# EAGLE schematic EEZ PSU power board r5B8 (EAGLE 6.1)
Assembly variants: Farnell, TME

## Sheet 1 of 5
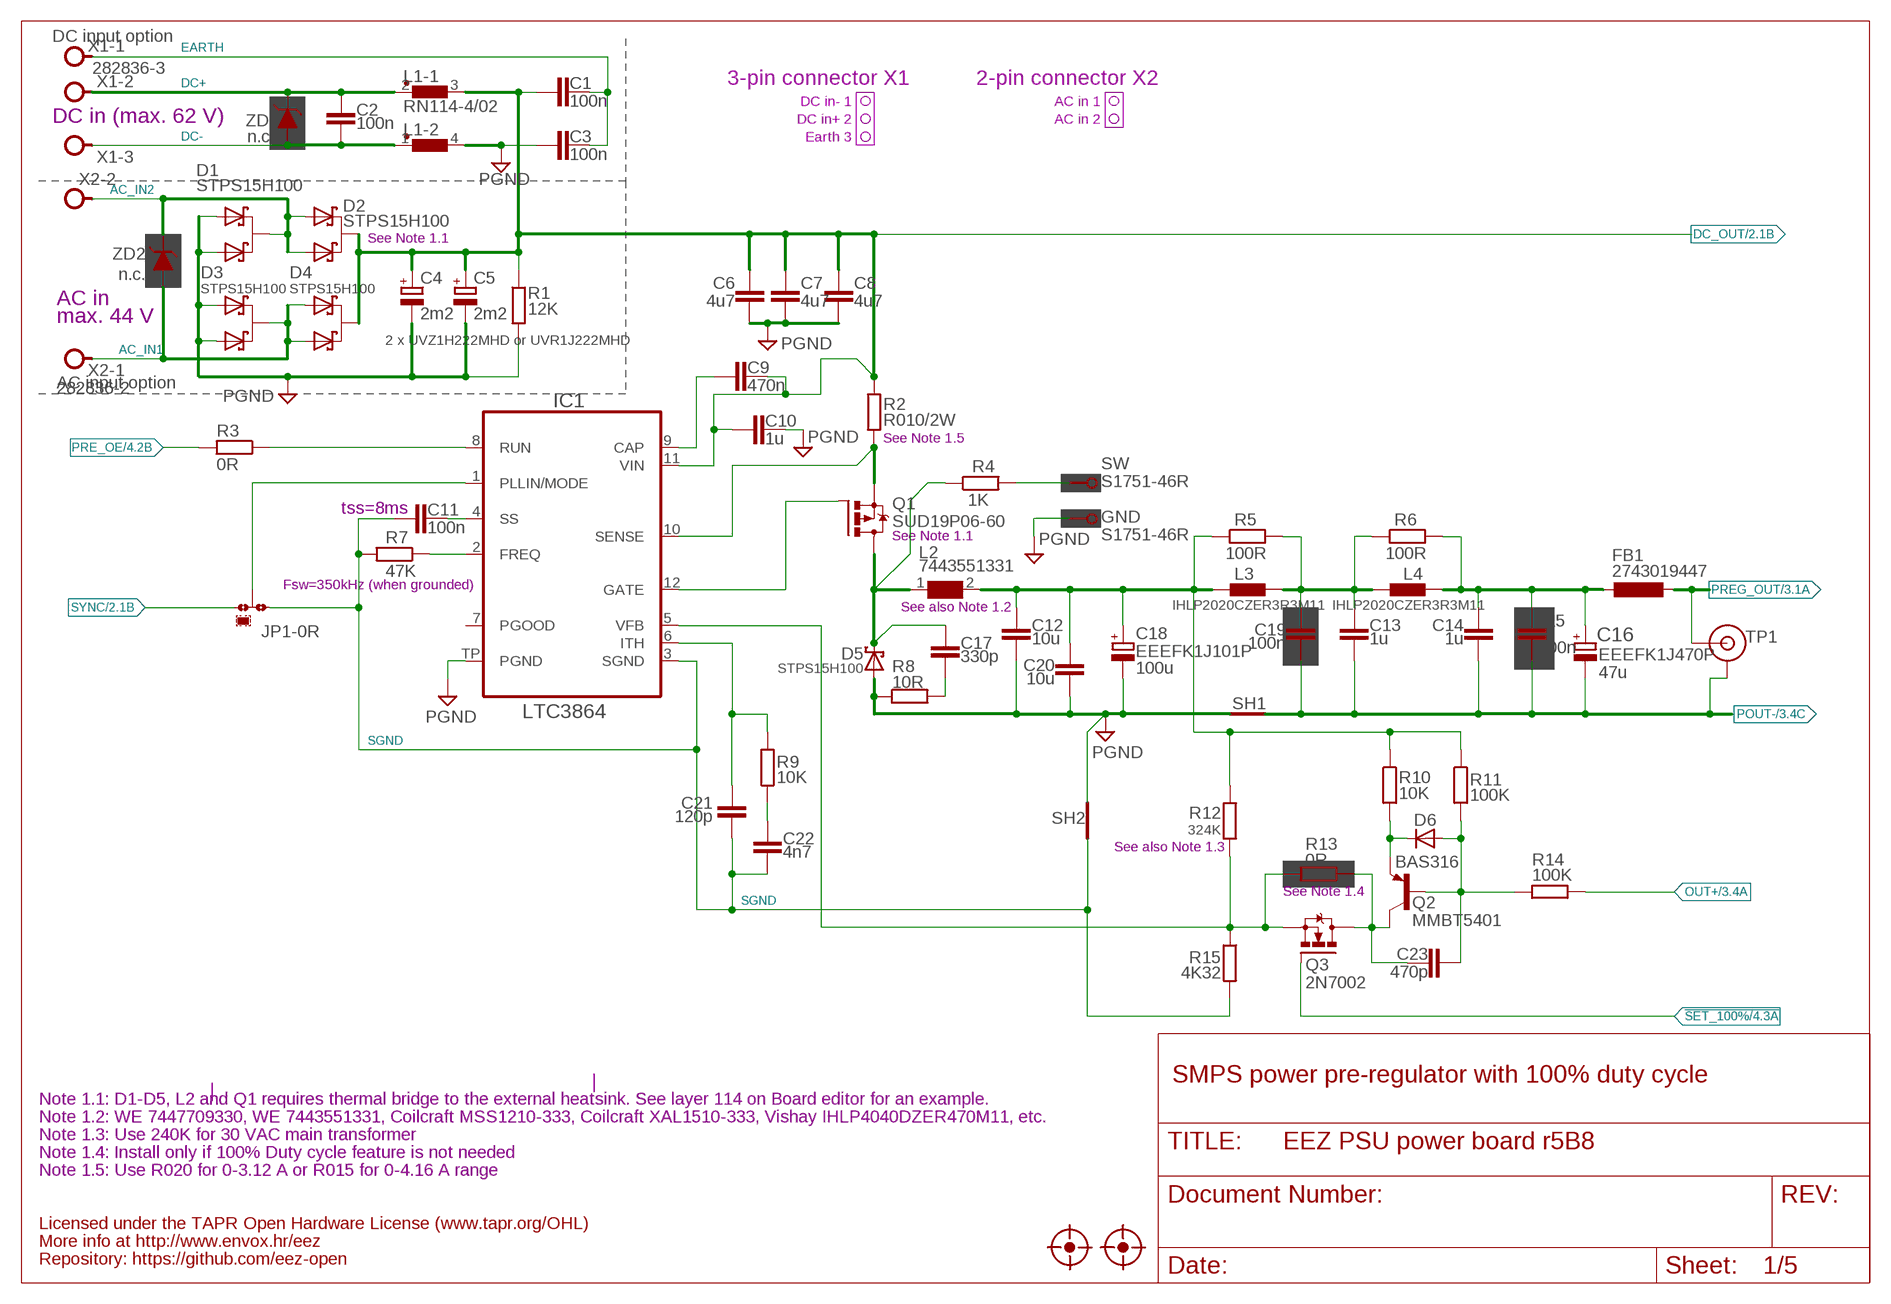
[diagram p0: schematic, sheet 1]

### Parts
C1  100n  C-EUC1206  [C1206]
C2  100n  C-EUC1206  [C1206]
C3  100n  C-EUC1206  [C1206]
C4  2m2  ECAP7.5G_18MM  [ECAP7.5/18]
C5  2m2  ECAP7.5G_18MM  [ECAP7.5/18]
C6  4u7  C-EUC1210  [C1210]
C7  4u7  C-EUC1210  [C1210]
C8  4u7  C-EUC1210  [C1210]
C9  470n  C-EUC0805  [C0805]
C10  1u  C-EUC1206  [C1206]
C11  100n  C-EUC0805  [C0805]
C12  10u  C-EUC1210  [C1210]
C13  1u  C-EUC1206  [C1206]
C14  1u  C-EUC1206  [C1206]
C15  100n  C-EUC0805  [C0805]
C16  EEEFK1J470P  EEE-FK1J470P-CASE-F  [CAPAE830X1050N]
C17  330p  C-EUC0805  [C0805]
C18  EEEFK1J101P  ECAPF  [PANASONIC_F]
C19  100n  C-EUC0805  [C0805]
C20  10u  C-EUC1210  [C1210]
C21  120p  C-EUC0805  [C0805]
C22  4n7  C-EUC0805  [C0805]
C23  470p  C-EUC0805  [C0805]
D1  STPS15H100  VS-6CWQ06FNPBF  [TO252@1]
D2  STPS15H100  VS-6CWQ06FNPBF  [TO252@1]
D3  STPS15H100  VS-6CWQ06FNPBF  [TO252@1]
D4  STPS15H100  VS-6CWQ06FNPBF  [TO252@1]
D5  STPS15H100  SCHOTTKYTO252  [TO252]
D6  BAS316  DIODE-SOD323-W  [SOD323-W]
FB1  2743019447  L-EUL1812  [L1812]
GND  S1751-46R  PCB_TEST_TABSMD  [S1751-46R]
IC1  LTC3864  [LTC_05-08-1666]
JP1  0R-JUMPA  [A0R-JMP]
L1  RN114-4/02  RN114  [RN114]
L2  7443551331  WE-HCI-7443551331_1350/1365  [WE-HCI_1350/1365]
L3  IHLP2020CZER3R3M11  IHLP-2020BZ-11  [IHLP-2020BZ-11]
L4  IHLP2020CZER3R3M11  IHLP-2020BZ-11  [IHLP-2020BZ-11]
Q1  SUD19P06-60  P-MOSFETDPAK  [TO229P990X239-3N]
Q2  MMBT5401  BC857B-PNP-SOT23-BEC  [SOT23-BEC]
Q3  2N7002  [SOT103P240X110-3N]
R1  12K  R-EU_R1206  [R1206]
R2  R010/2W  R-EU_R2512  [R2512]
R3  0R  R-EU_R0805  [R0805]
R4  1K  R-EU_R0805  [R0805]
R5  100R  R-EU_R0805  [R0805]
R6  100R  R-EU_R0805  [R0805]
R7  47K  R-EU_R0805  [R0805]
R8  10R  R-EU_R1206  [R1206]
R9  10K  R-EU_R0805  [R0805]
R10  10K  R-EU_R0805  [R0805]
R11  100K  R-EU_R0805  [R0805]
R12  324K  R-EU_R0805  [R0805]
R13  0R  R-EU_R0805  [R0805]
R14  100K  R-EU_R0805  [R0805]
R15  4K32  R-EU_R0805  [R0805]
SH1  Pgnd to Pout- short  SHORTNOHOLE  [SHORT_NOHOLE]
SH2  Sgnd to Pgnd short  SHORTNOHOLE  [SHORT_NOHOLE]
SW  S1751-46R  PCB_TEST_TABSMD  [S1751-46R]
TP1  TEST_POINT  [TP_1.1MM]
U$11  FIDUCIAL_2  [FIDUCIAL_DUAL]
U$12  FIDUCIAL_2  [FIDUCIAL_DUAL]
X1  282836-3  TBLOCK5.0_3A  [TBLOCK5.0_3]
X2  282836-2  TBLOCK5.0_2A  [TBLOCK5.0_2]
ZD1  n.c.  P6SMB68A  [DO214AA]
ZD2  n.c.  P6SMB68A  [DO214AA]

### Nets
!SET_100%: Q3.1(G) ; also sheet 4
AC_IN1: D3.3(C) D4.1(A1) D4.2(A2) X2.1 ZD2.A
AC_IN2: D1.3(C) D2.1(A1) D2.2(A2) X2.2 ZD2.C
DC+: C2.2 L1.2 X1.2 ZD1.C
DC-: C2.1 L1.1 X1.3 ZD1.A
DC_OUT: C1.2 C4.+ C5.+ C6.1 C7.1 C8.1 C9.2 C10.1 D2.3(C) D4.3(C) IC1.11(VIN) L1.3 R1.1 R2.1 ; also sheet 2,3
EARTH: C1.1 C3.2 X1.1
FB: IC1.5(VFB) Q3.2(S) R12.2 R13.2 R15.1
GND [gnd]: C3.1 C4.- C5.- C6.2 C7.2 C8.2 C10.2 C12.2 C18.2(-) C20.2 D1.1(A1) D1.2(A2) D3.1(A1) D3.2(A2) D5.1(A) D5.2(A) GND.P$1 IC1.TP(PGND) L1.4 R1.2 R8.1 SH1.P$2(GND_B) SH2.P$2(GND_B) ; supply symbol labelled PGND ; also sheet 2,3,4,5
L_OUT: C12.1 C18.1(+) C20.1 L2.2 L3.1 R5.1 R10.1 R11.1 R12.1
MODE: IC1.1(PLLIN/MODE) JP1.2
N$7: R4.2 SW.P$1
N$19: D6.C Q2.E R10.2
N$20: C21.1 IC1.6(ITH) R9.2
N$21: C22.1 R9.1
N$23: C9.1 IC1.9(CAP)
N$30: IC1.12(GATE) Q1.1(G)
N$31: IC1.2(FREQ) R7.1
N$33: C11.2 IC1.4(SS)
N$34: C23.1 Q2.C Q3.3(D) R13.1
N$35: C13.1 C19.2 L3.2 L4.1 R5.2 R6.1
N$36: IC1.8(RUN) R3.1
N$38: C17.2 R8.2
N$79: C23.2 D6.A Q2.B R11.2 R14.1
OUT+: R14.2 ; also sheet 3,5
P_OUT: C14.1 C15.1 C16.1 FB1.1 L4.2 R6.2
POUT-: C13.2 C14.2 C15.2 C16.2 C19.1 SH1.P$1(GND_A) TP1.GND ; also sheet 3
PRE_OE: R3.2 ; also sheet 4
PREG_OUT: FB1.2 TP1.TIP ; also sheet 3
SENSE: IC1.10(SENSE) Q1.3(S) R2.2
SGND: C11.1 C21.2 C22.2 IC1.3(SGND) JP1.1 R7.2 R15.2 SH2.P$1(GND_A)
SW: C17.1 D5.3(C) L2.1 Q1.2(D) R4.1
SYNC: JP1.3 ; also sheet 2
Unconnected: IC1.7(PGOOD)

### Notes on the sheet
- DC input option
- 3-pin connector X1 | 2-pin connector X2
- DC in- 1 | AC in 1
- DC in+ 2 | AC in 2
- DC in (max. 62 V)
- Earth 3
- See Note 1.1
- AC in
- max. 44 V
- 2 x UVZ1H222MHD or UVR1J222MHD
- AC input option
- See Note 1.5
- tss=8ms
- See Note 1.1
- Fsw=350kHz (when grounded)
- See also Note 1.2
- 100u | 47u
- See also Note 1.3
- See Note 1.4
- SMPS power pre-regulator with 100% duty cycle
- Note 1.1: D1-D5, L2 and Q1 requires thermal bridge to the external heatsink. See layer 114 on Board editor for an example.
- Note 1.2: WE 7447709330, WE 7443551331, Coilcraft MSS1210-333, Coilcraft XAL1510-333, Vishay IHLP4040DZER470M11, etc.
- Note 1.3: Use 240K for 30 VAC main transformer
- Note 1.4: Install only if 100% Duty cycle feature is not needed
- Note 1.5: Use R020 for 0-3.12 A or R015 for 0-4.16 A range
- Licensed under the TAPR Open Hardware License (www.tapr.org/OHL)
- More info at http://www.envox.hr/eez
- Repository: https://github.com/eez-open

## Sheet 2 of 5
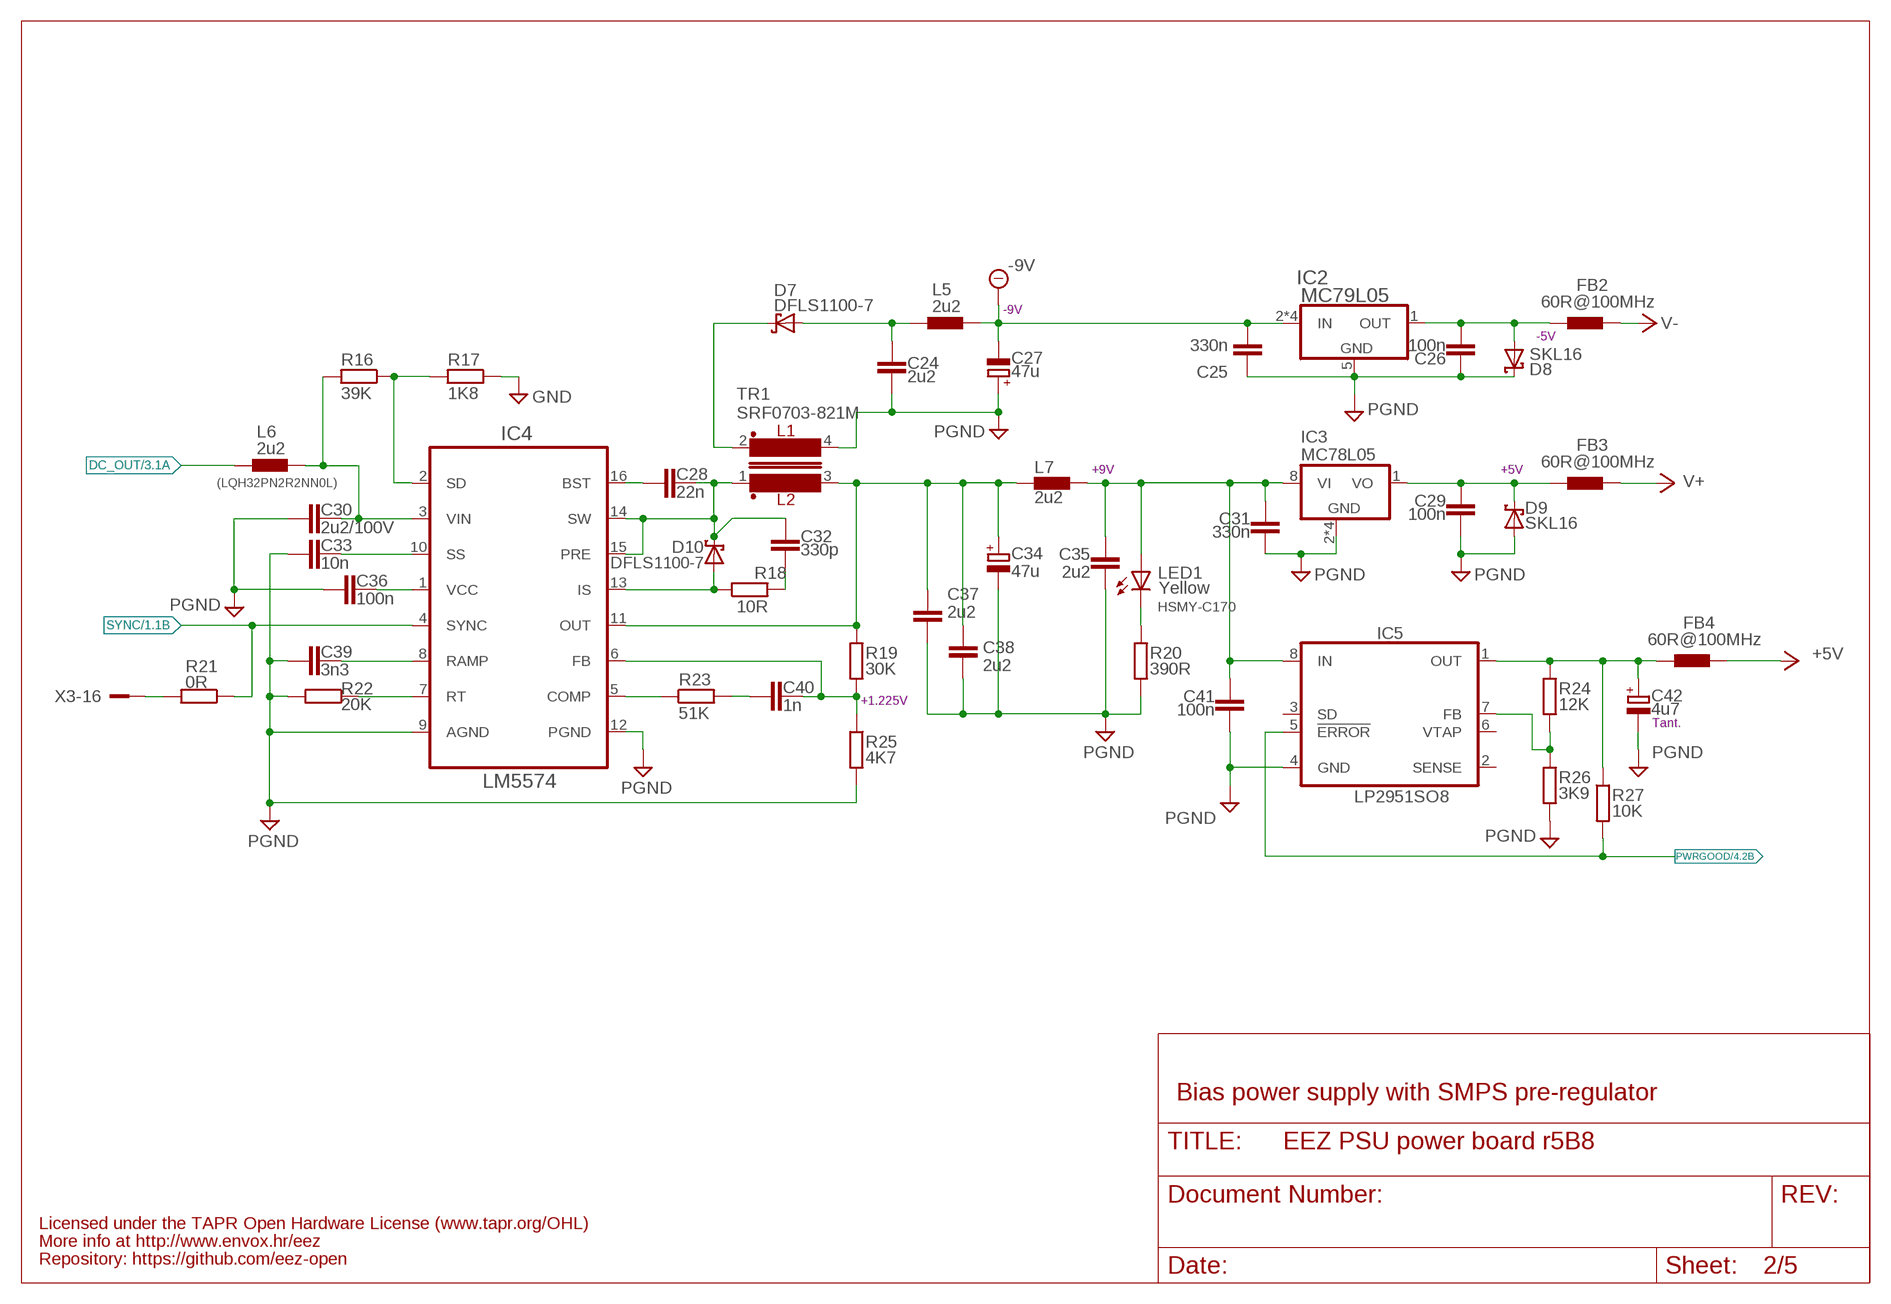
[diagram p1: schematic, sheet 2]

### Parts
C24  2u2  C-EUC0805  [C0805]
C25  330n  C-EUC0805  [C0805]
C26  100n  C-EUC0805  [C0805]
C27  47u  ECAPPANASONIC_H  [CAPAE660X610N]
C28  22n  C-EUC0805  [C0805]
C29  100n  C-EUC0805  [C0805]
C30  2u2/100V  C-EUC1210  [C1210]
C31  330n  C-EUC0805  [C0805]
C32  330p  C-EUC0805  [C0805]
C33  10n  C-EUC0805  [C0805]
C34  47u  ECAPPANASONIC_H  [CAPAE660X610N]
C35  2u2  C-EUC0805  [C0805]  (variant Farnell: 2320829)  (variant TME: CL21B225KAFNNNG )
C36  100n  C-EUC0805  [C0805]
C37  2u2  C-EUC0805  [C0805]  (variant Farnell: 2320829)  (variant TME: CL21B225KAFNNNG )
C38  2u2  C-EUC0805  [C0805]  (variant Farnell: 2320829)  (variant TME: CL21B225KAFNNNG )
C39  3n3  C-EUC0805  [C0805]
C40  1n  C-EUC0805  [C0805]
C41  100n  C-EUC0805  [C0805]
C42  4u7  ECAP1206  [EC1206]
D7  DFLS1100-7  SCHOTTKYSOD123  [SOD123]
D8  SKL16  SCHOTTKYSOD123  [SOD123]
D9  SKL16  SCHOTTKYSOD123  [SOD123]
D10  DFLS1100-7  SCHOTTKYSOD123  [SOD123]
FB2  60R@100MHz  FERRITE_BEAD0603  [BEAD0603]
FB3  60R@100MHz  FERRITE_BEAD0603  [BEAD0603]
FB4  60R@100MHz  FERRITE_BEAD0603  [BEAD0603]
IC2  MC79L05  MC79LXXSOIC  [SOIC127P600X173-8N]
IC3  MC78L05  MC78LXXSOIC8  [SOIC127P600X173-8N]
IC4  LM5574  [SOP65P640X110-16N]
IC5  LP2951SO8  [SOIC127P600X175-8N]
L5  2u2  L1210  [L1210]
L6  2u2  L1210  [L1210]
L7  2u2  L1210  [L1210]
LED1  HSMY-C170  LED0805  [LED_0805]
R16  39K  R-EU_R0805  [R0805]
R17  1K8  R-EU_R0805  [R0805]
R18  10R  R-EU_R1206  [R1206]
R19  30K  R-EU_R0805  [R0805]
R20  390R  R-EU_R0805  [R0805]
R21  0R  R-EU_R0805  [R0805]
R22  20K  R-EU_R0805  [R0805]
R23  51K  R-EU_R0805  [R0805]
R24  12K  R-EU_R0805  [R0805]
R25  4K7  R-EU_R0805  [R0805]
R26  3K9  R-EU_R0805  [R0805]
R27  10K  R-EU_R0805  [R0805]
TR1  SRF0703-821M  BOURNS_SRF0703INV  [SRF0703]
X3  SSW-113-02-T-D-RA  [SSW-113-02-T-D-RA]

### Nets
+5V: FB4.P$2 ; also sheet 3,4,5
+VNR: C31.1 C35.1 C41.1 IC3.8(VI) IC5.8(IN) L7.2 LED1.A
-9V: C25.2 C27.2(-) IC2.2(IN) IC2.3(IN) IC2.6(IN) IC2.7(IN) L5.2 ; also sheet 3
DC_OUT: L6.1 ; also sheet 1,3
DC_PREG1: C30.1 IC4.3(VIN) L6.2 R16.2
GND [gnd]: C24.2 C25.1 C26.1 C27.1(+) C29.2 C30.2 C31.2 C33.2 C34.2(-) C35.2 C36.1 C37.2 C38.2 C39.1 C41.2 C42.- D8.C D9.A IC2.5(GND) IC3.2(GND) IC3.3(GND) IC3.6(GND) IC3.7(GND) IC4.9(AGND) IC4.12(PGND) IC5.4(GND) R17.1 R20.2 R22.2 R25.2 R26.2 TR1.4 ; supply symbol labelled PGND ; also sheet 1,3,4,5
IS: D10.A IC4.13(IS) R18.1
N$4: C26.2 D8.A FB2.P$1 IC2.1(OUT)
N$5: C29.1 D9.C FB3.P$1 IC3.1(VO)
N$6: C42.+ FB4.P$1 IC5.1(OUT) R24.1 R27.1
N$24: R21.2 X3.16
N$43: LED1.C R20.1
N$46: C32.2 R18.2
N$64: IC5.7(FB) R24.2 R26.1
N$77: C40.2 R23.2
N$128: C40.1 IC4.6(FB) R19.2 R25.1
N$131: C28.2 IC4.16(BST)
N$135: IC4.5(COMP) R23.1
N$165: IC4.7(RT) R22.1
N$166: C36.2 IC4.1(VCC)
N$167: C39.2 IC4.8(RAMP)
N$168: C33.1 IC4.10(SS)
N$179: C24.1 D7.A L5.1
N$180: IC4.2(SD) R16.1 R17.2
PWRGOOD: IC5.5(!ERROR) R27.2 ; also sheet 4
SW1: C28.1 C32.1 D10.C IC4.14(SW) IC4.15(PRE) TR1.1
SYNC: IC4.4(SYNC) R21.1 ; also sheet 1
V+: FB3.P$2 ; also sheet 3,4,5
V-: FB2.P$2 ; also sheet 3,4,5
VOUT+: C34.1(+) C37.1 C38.1 IC4.11(OUT) L7.1 R19.1 TR1.3
VOUT-: D7.C TR1.2
Unconnected: IC5.2(SENSE) IC5.3(SD) IC5.6(VTAP)

### Notes on the sheet
- -9V
- -5V
- +9V | +5V
- (LQH32PN2R2NN0L)
- Yellow
- +1.225V
- Tant.
- Bias power supply with SMPS pre-regulator
- Licensed under the TAPR Open Hardware License (www.tapr.org/OHL)
- More info at http://www.envox.hr/eez
- Repository: https://github.com/eez-open

## Sheet 3 of 5
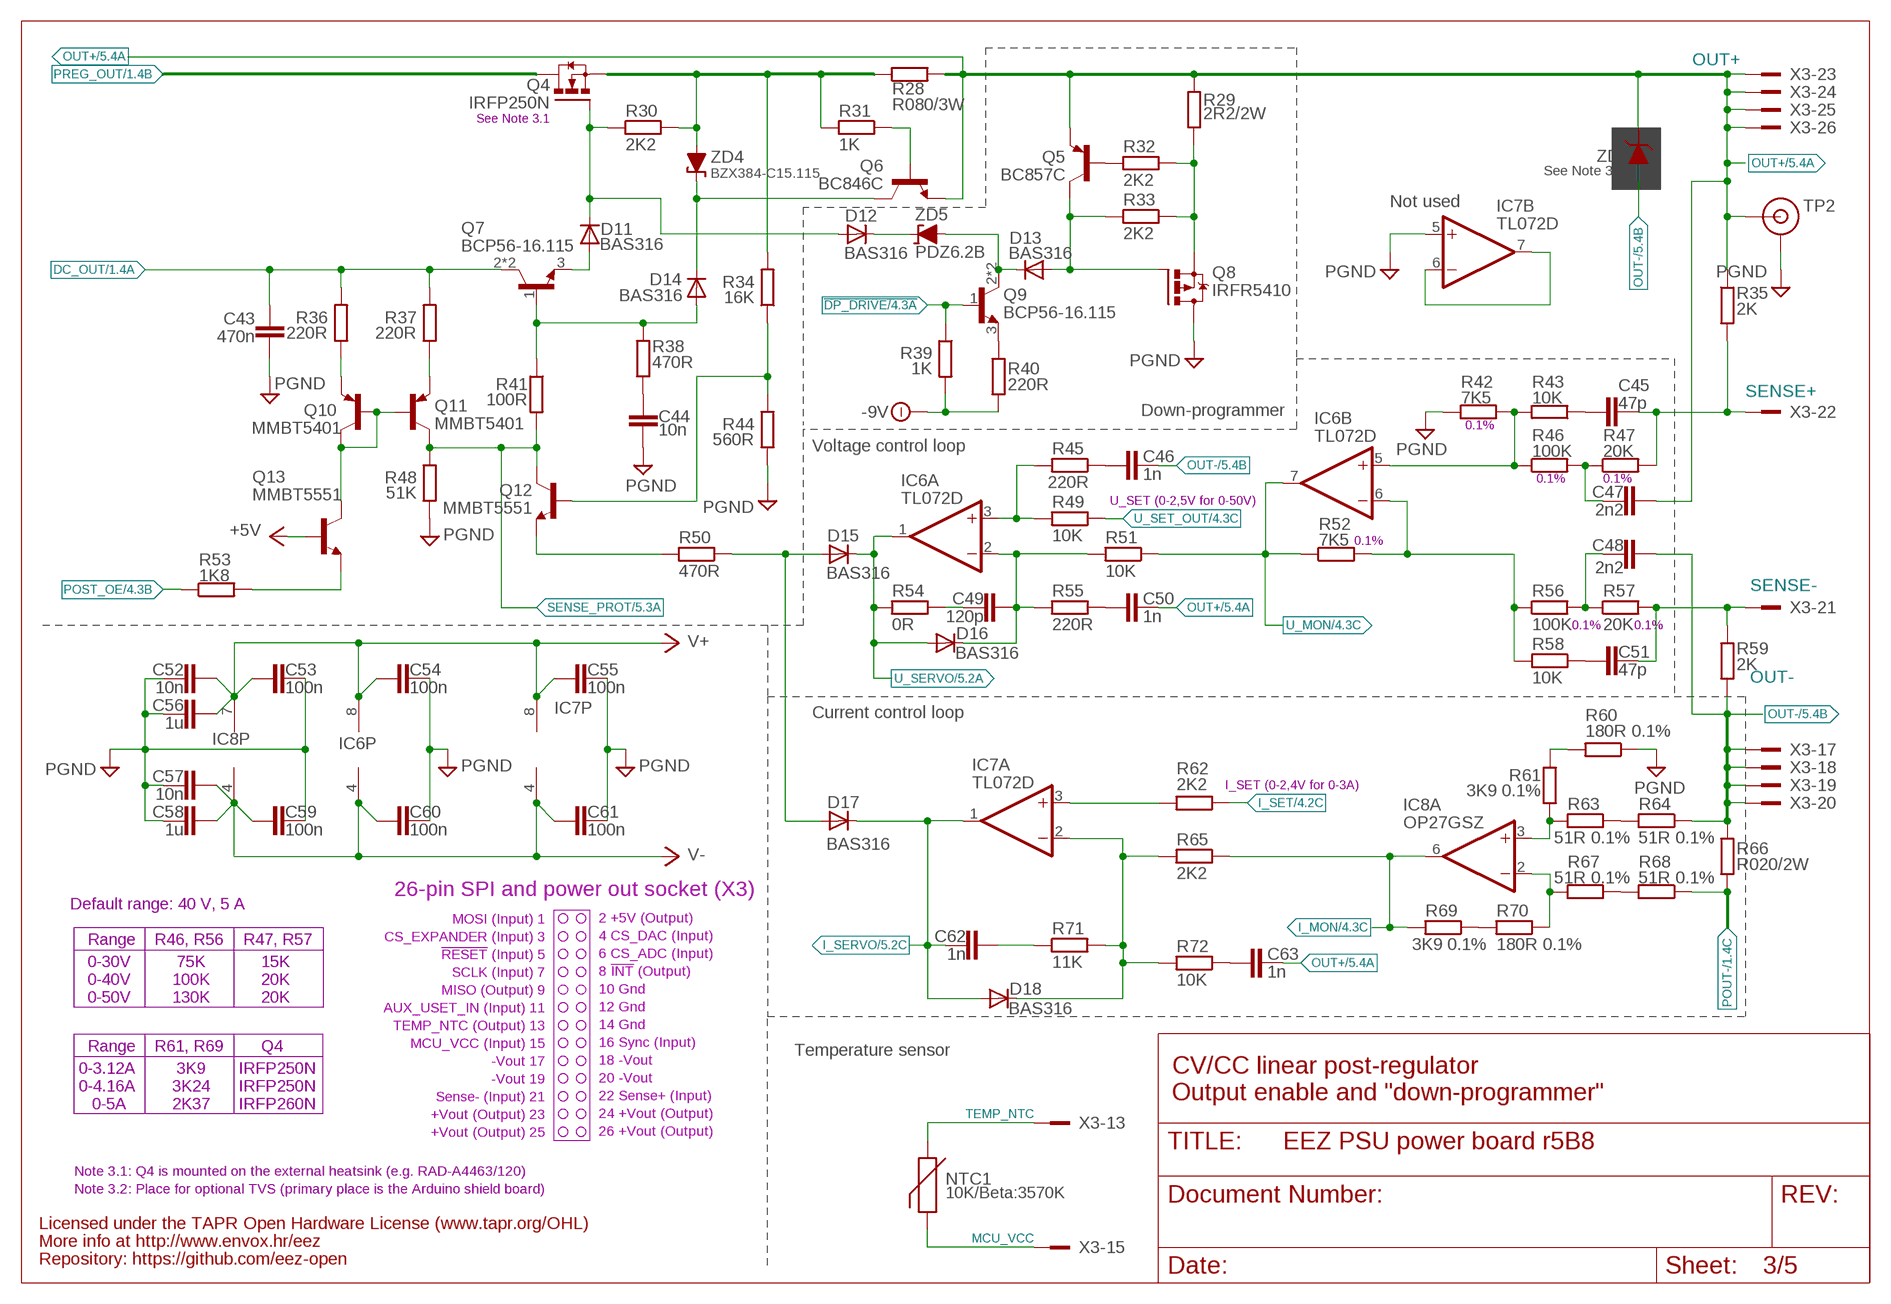
[diagram p2: schematic, sheet 3]

### Parts
C43  470n  C-EUC1812  [C1812]
C44  10n  C-EUC0805  [C0805]
C45  47p  C-EUC0805  [C0805]
C46  1n  C-EUC0805  [C0805]
C47  2n2  C-EUC0805  [C0805]
C48  2n2  C-EUC0805  [C0805]
C49  120p  C-EUC0805  [C0805]
C50  1n  C-EUC0805  [C0805]
C51  47p  C-EUC0805  [C0805]
C52  10n  C-EUC0805  [C0805]
C53  100n  C-EUC0603  [C0603]
C54  100n  C-EUC0603  [C0603]
C55  100n  C-EUC0603  [C0603]
C56  1u  C-EUC0805  [C0805]
C57  10n  C-EUC0805  [C0805]
C58  1u  C-EUC0805  [C0805]
C59  100n  C-EUC0603  [C0603]
C60  100n  C-EUC0603  [C0603]
C61  100n  C-EUC0603  [C0603]
C62  1n  C-EUC0805  [C0805]
C63  1n  C-EUC0805  [C0805]
D11  BAS316  DIODE-SOD323-W  [SOD323-W]
D12  BAS316  DIODE-SOD323-W  [SOD323-W]
D13  BAS316  DIODE-SOD323-W  [SOD323-W]
D14  BAS316  DIODE-SOD323-W  [SOD323-W]
D15  BAS316  DIODE-SOD323-W  [SOD323-W]
D16  BAS316  DIODE-SOD323-W  [SOD323-W]
D17  BAS316  DIODE-SOD323-W  [SOD323-W]
D18  BAS316  DIODE-SOD323-W  [SOD323-W]
IC6  TL072D  TL072SOIC8  [SOIC127P600X173-8N]
IC7  TL072D  TL072SOIC8  [SOIC127P600X173-8N]
IC8  OP27GSZ  OP27GSZSO8  [SOIC127P600X173-8N]
NTC1  10K/Beta:3570K  NTC0805  [R_0204/5+0805]
Q4  IRFP250N  IRFP240BOTTOM  [TO247BH-CLR]
Q5  BC857C  BC857C-PNP-SOT23-BEC  [SOT23-BEC]
Q6  BC846C  BC846B-NPN-SOT23-BEC  [SOT23-BEC]
Q7  BCP56-16.115  BCP56  [SOT230P700X180-4N]
Q8  IRFR5410  P-MOSFETDPAK  [TO229P990X239-3N]
Q9  BCP56-16.115  BCP56  [SOT230P700X180-4N]
Q10  MMBT5401  BC857B-PNP-SOT23-BEC  [SOT23-BEC]
Q11  MMBT5401  BC857B-PNP-SOT23-BEC  [SOT23-BEC]
Q12  MMBT5551  MMBT5551LT1-NPN-SOT23-BEC  [SOT23-BEC]
Q13  MMBT5551  MMBT5551LT1-NPN-SOT23-BEC  [SOT23-BEC]
R28  R080/3W  R-EU_R2512  [R2512]
R29  2R2/2W  R-EU_R2512  [R2512]
R30  2K2  R-EU_R0805  [R0805]
R31  1K  R-EU_R0805  [R0805]
R32  2K2  R-EU_R0805  [R0805]
R33  2K2  R-EU_R0805  [R0805]
R34  16K  R-EU_R0805  [R0805]
R35  2K  R-EU_R0805  [R0805]
R36  220R  R-EU_R0805  [R0805]
R37  220R  R-EU_R0805  [R0805]
R38  470R  R-EU_R0805  [R0805]
R39  1K  R-EU_R0805  [R0805]
R40  220R  R-EU_R0805  [R0805]
R41  100R  R-EU_R0805  [R0805]
R42  7K5  R-EU_R0805  [R0805]
R43  10K  R-EU_R0805  [R0805]
R44  560R  R-EU_R0805  [R0805]
R45  220R  R-EU_R0805  [R0805]
R46  100K  R-EU_R0805  [R0805]
R47  20K  R-EU_R0805  [R0805]
R48  51K  R-EU_R0805  [R0805]
R49  10K  R-EU_R0805  [R0805]
R50  470R  R-EU_R0805  [R0805]
R51  10K  R-EU_R0805  [R0805]
R52  7K5  R-EU_R0805  [R0805]
R53  1K8  R-EU_R0805  [R0805]
R54  0R  R-EU_R0805  [R0805]
R55  220R  R-EU_R0805  [R0805]
R56  100K  R-EU_R0805  [R0805]
R57  20K  R-EU_R0805  [R0805]
R58  10K  R-EU_R0805  [R0805]
R59  2K  R-EU_R0805  [R0805]
R60  180R 0.1%  R-EU_R0805  [R0805]
R61  3K9 0.1%  R-EU_R0805  [R0805]
R62  2K2  R-EU_R0805  [R0805]
R63  51R 0.1%  R-EU_R0805  [R0805]
R64  51R 0.1%  R-EU_R0805  [R0805]
R65  2K2  R-EU_R0805  [R0805]
R66  R020/2W  R-EU_R2512  [R2512]
R67  51R 0.1%  R-EU_R0805  [R0805]
R68  51R 0.1%  R-EU_R0805  [R0805]
R69  3K9 0.1%  R-EU_R0805  [R0805]
R70  180R 0.1%  R-EU_R0805  [R0805]
R71  11K  R-EU_R0805  [R0805]
R72  10K  R-EU_R0805  [R0805]
TP2  TEST_POINT  [TP_1.1MM]
ZD3  See Note 3.2  P6SMB68A  [DO214AA]
ZD4  BZX384-C15.115  ZENER-DIODESOD323  [SOD323-W]
ZD5  PDZ6.2B  ZENER-DIODESOD323  [SOD323-W]

### Nets
!DP_DRIVE: Q9.1(B) R39.1 ; also sheet 4
+5V: Q13.B ; also sheet 2,4,5
-9V: R39.2 R40.2 ; also sheet 2
DC_OUT: C43.1 Q7.2(C) Q7.4(C) R36.2 R37.2 ; also sheet 1,2
GND [gnd]: C43.2 C44.2 C52.1 C53.2 C54.1 C55.1 C56.1 C57.1 C58.1 C59.2 C60.1 C61.1 IC7.5(B:+IN) Q8.2(D) R42.1 R44.1 R48.1 R60.1 TP2.GND ; supply symbol labelled PGND ; also sheet 1,2,4,5
I_MON: IC8.6(A:OUT) R65.1 R69.2 ; also sheet 4
I_SERVO: C62.2 D17.C D18.A IC7.1(A:OUT) ; also sheet 5
I_SET: R62.1 ; also sheet 4
ISENSE+: IC8.3(A:+IN) R61.2 R63.2
ISENSE-: IC8.2(A:-IN) R67.2 R70.1
MCU_VCC: NTC1.2 NTC1.2.1 X3.15
N$1: Q9.3(E) R40.1
N$2: Q5.B R32.2
N$3: C45.2 R43.1
N$8: R63.1 R64.2
N$10: C51.2 R58.1
N$13: R67.1 R68.2
N$14: R69.1 R70.2
N$15: R60.2 R61.1
N$16: IC7.6(B:-IN) IC7.7(B:OUT)
N$17: C48.1 R56.2 R57.1
N$18: C49.2 R54.1
N$22: C63.2 R72.1
N$26: C46.2 R45.1
N$27: C50.2 R55.1
N$29: IC6.3(A:+IN) R45.2 R49.2
N$32: C49.1 D16.C IC6.2(A:-IN) R51.2 R55.2
N$37: D18.C IC7.2(A:-IN) R65.2 R71.2 R72.2
N$44: Q12.B R34.1 R44.2
N$50: IC7.3(A:+IN) R62.2
N$54: D15.A D17.A R50.1
N$56: D11.C D12.A Q4.G R30.1
N$62: D11.A Q7.3(E)
N$65: D14.A Q7.1(B) R38.2 R41.1
N$67: C44.1 R38.1
N$117: C47.1 R46.2 R47.1
N$129: D14.C Q6.C ZD4.C
N$143: D12.C ZD5.C
N$145: Q12.E R50.2
N$146: Q8.3(S) R29.1 R32.1 R33.1
N$147: D13.A Q5.C Q8.1(G) R33.2
N$150: IC6.5(B:+IN) R42.2 R43.2 R46.1
N$158: IC6.6(B:-IN) R52.2 R56.1 R58.2
N$172: C62.1 R71.1
N$183: Q11.E R37.1
N$184: Q10.E R36.1
N$186: Q13.E R53.2
N$201: Q6.B R31.1
OUT+: C47.2 C50.1 C63.1 Q5.E Q6.E R28.2 R29.2 R35.1 TP2.TIP X3.23 X3.24 X3.25 X3.26 ZD3.C ; also sheet 1,5
OUT-: C46.1 C48.2 R59.2 R64.1 R66.1 X3.17 X3.18 X3.19 X3.20 ZD3.A ; also sheet 5
POST_OE: R53.1 ; also sheet 4
POUT-: R66.2 R68.1 ; also sheet 1
PREG_OUT: Q4.D ; also sheet 1
Q4_OUT: Q4.S R28.1 R30.2 R31.2 R34.2 ZD4.A
Q7C: Q10.B Q10.C Q11.B Q13.C
Q9C: D13.C Q9.2(C) Q9.4(C) ZD5.A
SENSE+: C45.1 R35.2 R47.2 X3.22 ; also sheet 5
SENSE-: C51.1 R57.2 R59.1 X3.21 ; also sheet 5
SENSE_PROT: Q11.C Q12.C R41.2 R48.2 ; also sheet 5
TEMP_NTC: NTC1.1 NTC1.1.1 X3.13
U_MON: IC6.7(B:OUT) R51.1 R52.1 ; also sheet 4
U_SERVO: D15.C D16.A IC6.1(A:OUT) R54.2 ; also sheet 5
U_SET_OUT: R49.1 ; also sheet 4
V+: C52.2 C53.1 C54.2 C55.2 C56.2 IC6.8(P:V+) IC7.8(P:V+) IC8.7(P:V+) ; also sheet 2,4,5
V-: C57.2 C58.2 C59.1 C60.2 C61.2 IC6.4(P:V-) IC7.4(P:V-) IC8.4(P:V-) ; also sheet 2,4,5

### Notes on the sheet
- See Note 3.1
- Not used
- Down-programmer
- 0.1%
- Voltage control loop
- 0.1% | 0.1%
- U_SET (0-2,5V for 0-50V)
- 0.1%
- 0.1% | 0.1%
- Current control loop
- I_SET (0-2,4V for 0-3A)
- 26-pin SPI and power out socket (X3)
- Default range: 40 V, 5 A
- MOSI (Input) 1
- 2 +5V (Output)
- CS_EXPANDER (Input) 3
- 4 CS_DAC (Input)
- Range | R46, R56 | R47, R57
- !RESET! (Input) 5
- 6 CS_ADC (Input)
- 0-30V | 75K | 15K | SCLK (Input) 7
- 8 !INT! (Output)
- 0-40V | 100K | 20K | MISO (Output) 9
- 10 Gnd
- 0-50V | 130K | 20K | AUX_USET_IN (Input) 11
- 12 Gnd
- TEMP_NTC (Output) 13
- 14 Gnd
- MCU_VCC (Input) 15
- 16 Sync (Input)
- Range | R61, R69 | Q4
- -Vout 17 | Temperature sensor
- 18 -Vout
- 0-3.12A | 3K9 | IRFP250N | -Vout 19 | CV/CC linear post-regulator
- 20 -Vout
- 0-4.16A | 3K24 | IRFP250N | Sense- (Input) 21
- 22 Sense+ (Input) | Output enable and "down-programmer"
- 0-5A | 2K37 | IRFP260N | +Vout (Output) 23
- 24 +Vout (Output)
- +Vout (Output) 25
- 26 +Vout (Output)
- Note 3.1: Q4 is mounted on the external heatsink (e.g. RAD-A4463/120)
- Note 3.2: Place for optional TVS (primary place is the Arduino shield board)
- Licensed under the TAPR Open Hardware License (www.tapr.org/OHL)
- More info at http://www.envox.hr/eez
- Repository: https://github.com/eez-open

## Sheet 4 of 5
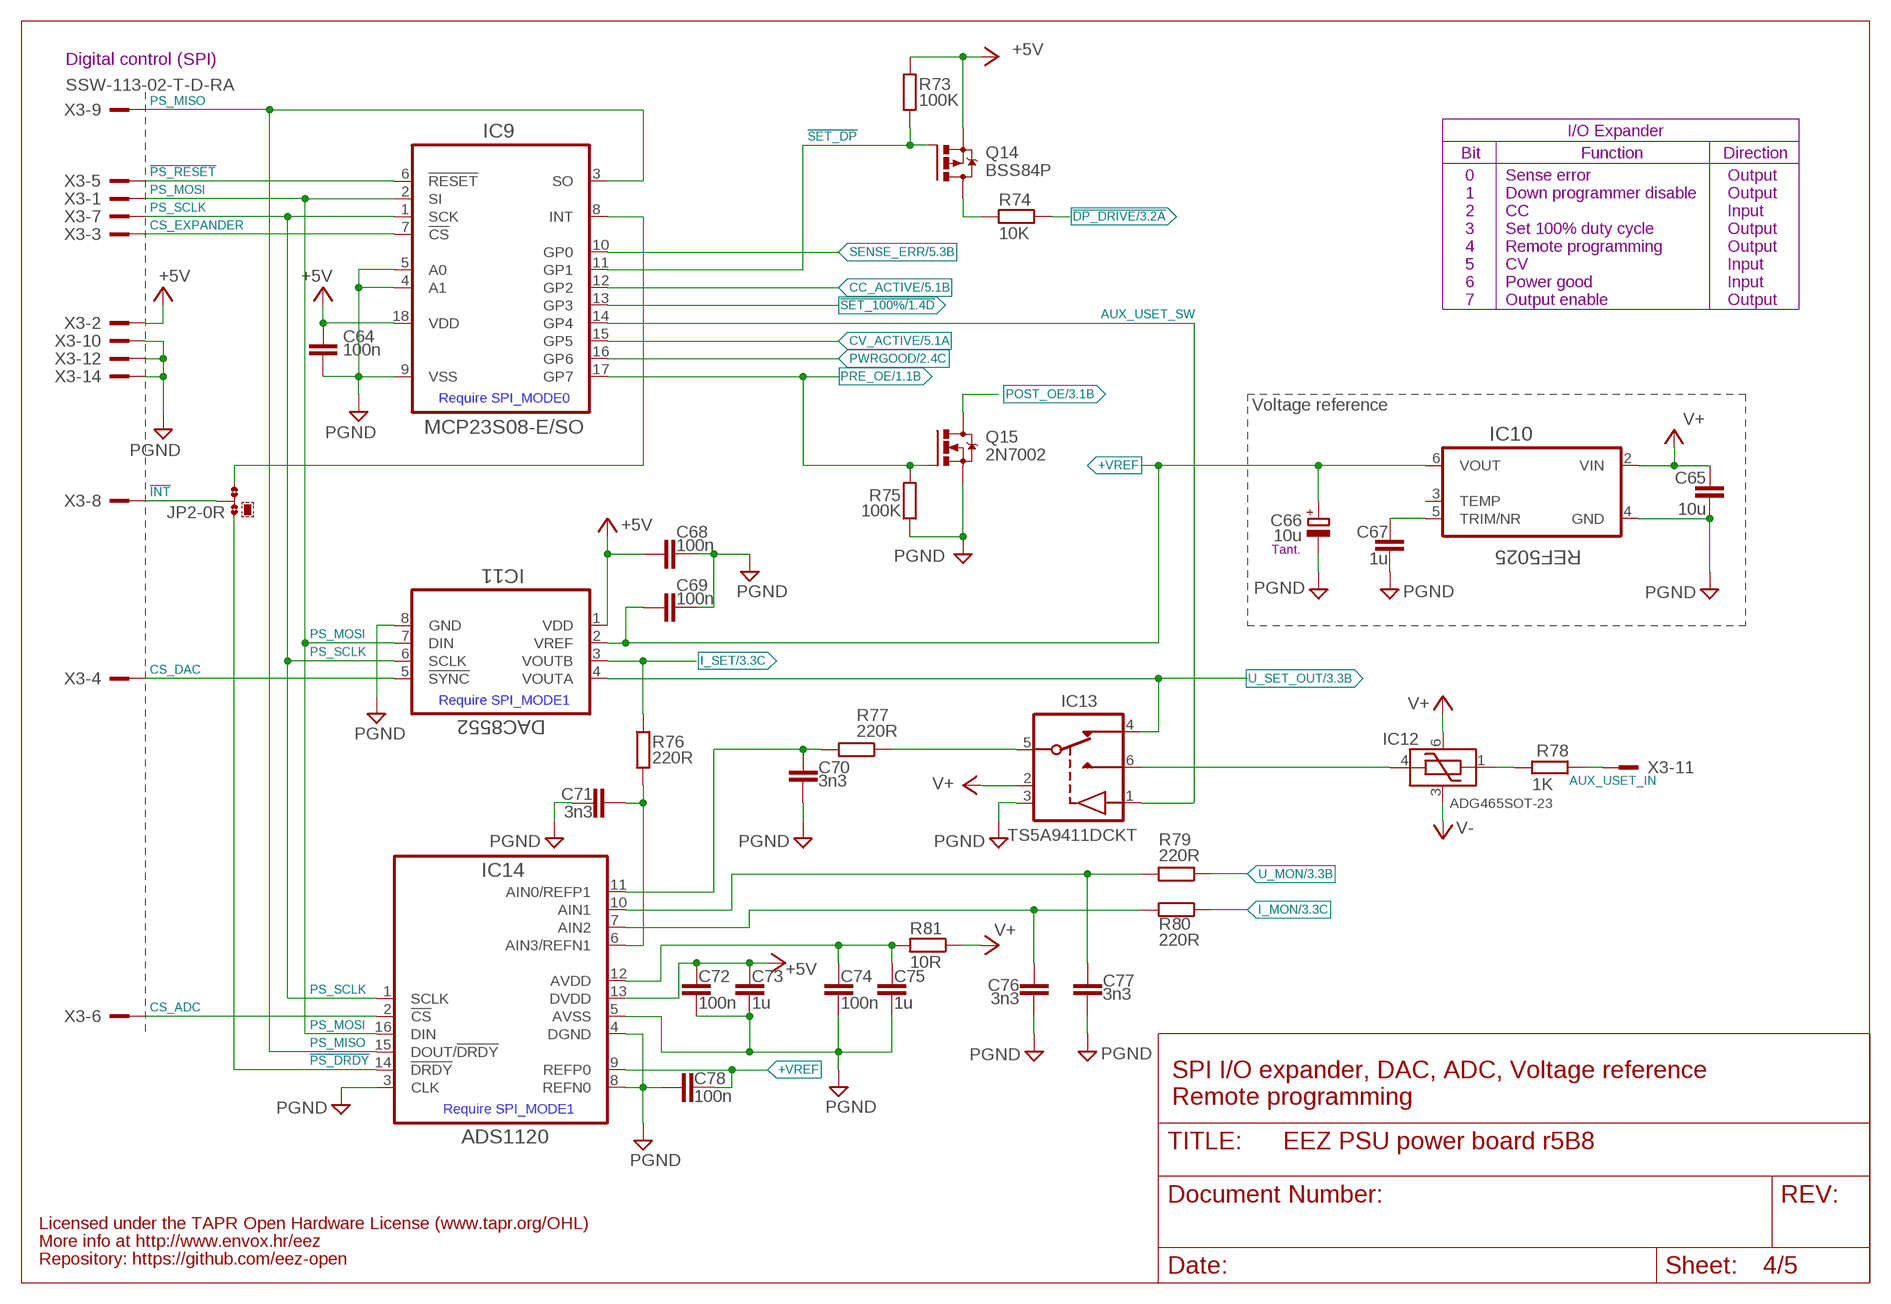
[diagram p3: schematic, sheet 4]

### Parts
C64  100n  C-EUC0603  [C0603]
C65  10u  C-EUC1206  [C1206]
C66  10u  ECAP1206  [EC1206]
C67  1u  C-EUC0805  [C0805]
C68  100n  C-EUC0603  [C0603]
C69  100n  C-EUC0603  [C0603]
C70  3n3  C-EUC0805  [C0805]
C71  3n3  C-EUC0805  [C0805]
C72  100n  C-EUC0603  [C0603]
C73  1u  C-EUC0805  [C0805]
C74  100n  C-EUC0603  [C0603]
C75  1u  C-EUC0805  [C0805]
C76  3n3  C-EUC0805  [C0805]
C77  3n3  C-EUC0805  [C0805]
C78  100n  C-EUC0603  [C0603]
IC9  MCP23S08-E/SO  MCP23S08  [SOIC127P1030X265-18N]
IC10  REF5025  REF50XX  [SOIC127P600X175-8N]
IC11  DAC8552  DAC8552_DGK_8M  [DGK8-M]
IC12  ADG465SOT-23  [SOT95P280X145-6N]
IC13  TS5A9411DCKT  [SOT65P210X110-6N]
IC14  ADS1120  ADS1120TSSOP-16  [PW(R-PDSO-G16)]
JP2  0R-JUMPA  [A0R-JMP]
Q14  BSS84P  IRLML2246TRPBF  [SOT95P237X112-3N]
Q15  2N7002  [SOT103P240X110-3N]
R73  100K  R-EU_R0805  [R0805]
R74  10K  R-EU_R0805  [R0805]
R75  100K  R-EU_R0805  [R0805]
R76  220R  R-EU_R0805  [R0805]
R77  220R  R-EU_R0805  [R0805]
R78  1K  R-EU_R0805  [R0805]
R79  220R  R-EU_R0805  [R0805]
R80  220R  R-EU_R0805  [R0805]
R81  10R  R-EU_R0805  [R0805]

### Nets
!DP_DRIVE: R74.1 ; also sheet 3
!INT: JP2.2 X3.8
!PS_DRDY: IC14.14(!DRDY) JP2.3
!PS_RESET: IC9.6(!RESET) X3.5
!SET_100%: IC9.13(GP3) ; also sheet 1
!SET_DP: IC9.11(GP1) Q14.1(G) R73.2
+5V: C64.1 C68.2 C72.2 C73.2 IC9.18(VDD) IC11.1(VDD) IC14.13(DVDD) Q14.2(S) R73.1 X3.2 ; also sheet 2,3,5
+VREF: C66.+ C69.2 C78.2 IC10.6(VOUT) IC11.2(VREF) IC14.9(REFP0)
AUX_USET_IN: R78.2 X3.11
AUX_USET_SW: IC9.14(GP4) IC13.1(IN)
CC_ACTIVE: IC9.12(GP2) ; also sheet 5
CS_ADC: IC14.2(!CS) X3.6
CS_DAC: IC11.5(!SYNC) X3.4
CS_EXPANDER: IC9.7(!CS) X3.3
CV_ACTIVE: IC9.15(GP5) ; also sheet 5
DP_LED: Q14.3(D) R74.2
GND [gnd]: C64.2 C65.2 C66.- C67.2 C68.1 C69.1 C70.1 C71.2 C72.1 C73.1 C74.1 C75.1 C76.1 C77.1 C78.1 IC9.4(A1) IC9.5(A0) IC9.9(VSS) IC10.4(GND) IC11.8(GND) IC13.3(GND) IC14.3(CLK) IC14.4(DGND) IC14.5(AVSS) IC14.8(REFN0) Q15.2(S) R75.1 X3.10 X3.12 X3.14 ; supply symbol labelled PGND ; also sheet 1,2,3,5
I_MON: R80.1 ; also sheet 3
I_SET: IC11.3(VOUTB) R76.1 ; also sheet 3
INT_EXP: IC9.8(INT) JP2.1
N$9: IC12.4(VS) IC13.6(S1)
N$11: C67.1 IC10.5(TRIM/NR)
N$12: IC12.1(VD) R78.1
N$28: C77.2 IC14.10(AIN1) R79.2
N$41: C70.2 IC14.11(AIN0/REFP1) R77.2
N$42: C74.2 C75.2 IC14.12(AVDD) R81.2
N$51: C71.1 IC14.6(AIN3/REFN1) R76.2
N$55: C76.2 IC14.7(AIN2) R80.2
POST_OE: Q15.3(D) ; also sheet 3
PRE_OE: IC9.17(GP7) Q15.1(G) R75.2 ; also sheet 1
PS_MISO: IC9.3(SO) IC14.15(DOUT/!DRDY) X3.9
PS_MOSI: IC9.2(SI) IC11.7(DIN) IC14.16(DIN) X3.1
PS_SCLK: IC9.1(SCK) IC11.6(SCLK) IC14.1(SCLK) X3.7
PWRGOOD: IC9.16(GP6) ; also sheet 2
SENSE_ERR: IC9.10(GP0) ; also sheet 5
U_MON: R79.1 ; also sheet 3
U_SET: IC13.5(D) R77.1
U_SET_OUT: IC11.4(VOUTA) IC13.4(S2) ; also sheet 3
V+: C65.1 IC10.2(VIN) IC12.6(VDD) IC13.2(VDD) R81.1 ; also sheet 2,3,5
V-: IC12.3(VSS) ; also sheet 2,3,5
Unconnected: IC10.3(TEMP)

### Notes on the sheet
- Digital control (SPI)
- I/O Expander
- Bit | Function | Direction
- 0 | Sense error | Output
- 1 | Down programmer disable | Output
- 2 | CC | Input
- 3 | Set 100% duty cycle | Output
- 4 | Remote programming | Output
- 5 | CV | Input
- 6 | Power good | Input
- 7 | Output enable | Output
- Voltage reference
- Require SPI_MODE0
- Tant.
- Require SPI_MODE1
- SPI I/O expander, DAC, ADC, Voltage reference
- Remote programming
- Require SPI_MODE1
- Licensed under the TAPR Open Hardware License (www.tapr.org/OHL)
- More info at http://www.envox.hr/eez
- Repository: https://github.com/eez-open

## Sheet 5 of 5
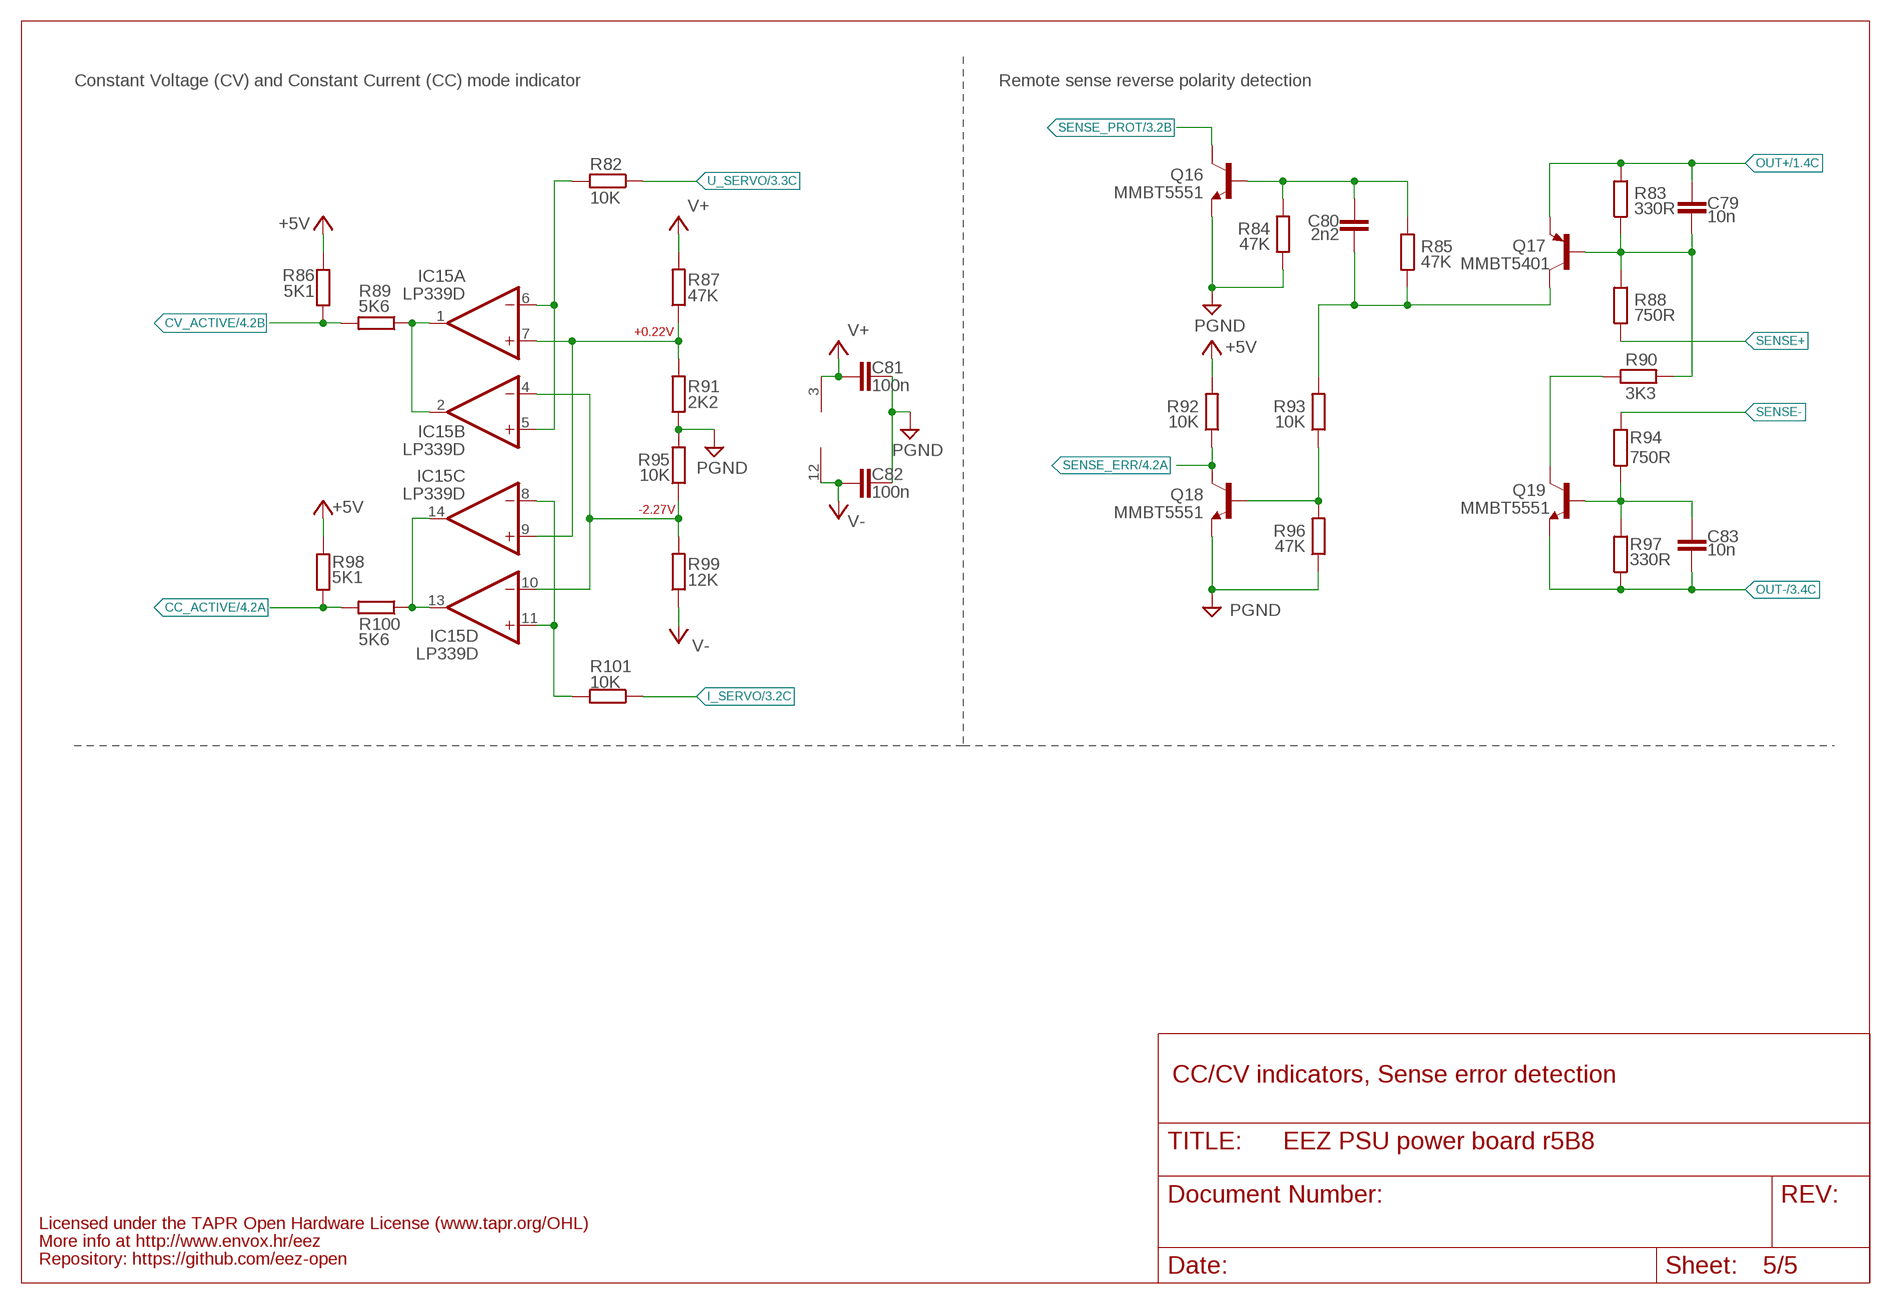
[diagram p4: schematic, sheet 5]

### Parts
C79  10n  C-EUC0805  [C0805]
C80  2n2  C-EUC0805  [C0805]
C81  100n  C-EUC0603  [C0603]
C82  100n  C-EUC0603  [C0603]
C83  10n  C-EUC0805  [C0805]
IC15  LP339D  LM339SO14  [SOIC127P600X175-14N]
Q16  MMBT5551  MMBT5551LT1-NPN-SOT23-BEC  [SOT23-BEC]
Q17  MMBT5401  BC857B-PNP-SOT23-BEC  [SOT23-BEC]
Q18  MMBT5551  MMBT5551LT1-NPN-SOT23-BEC  [SOT23-BEC]
Q19  MMBT5551  MMBT5551LT1-NPN-SOT23-BEC  [SOT23-BEC]
R82  10K  R-EU_R0805  [R0805]
R83  330R  R-EU_R0805  [R0805]
R84  47K  R-EU_R0805  [R0805]
R85  47K  R-EU_R0805  [R0805]
R86  5K1  R-EU_R0805  [R0805]
R87  47K  R-EU_R0805  [R0805]
R88  750R  R-EU_R0805  [R0805]
R89  5K6  R-EU_R0805  [R0805]
R90  3K3  R-EU_R0805  [R0805]
R91  2K2  R-EU_R0805  [R0805]
R92  10K  R-EU_R0805  [R0805]
R93  10K  R-EU_R0805  [R0805]
R94  750R  R-EU_R0805  [R0805]
R95  10K  R-EU_R0805  [R0805]
R96  47K  R-EU_R0805  [R0805]
R97  330R  R-EU_R0805  [R0805]
R98  5K1  R-EU_R0805  [R0805]
R99  12K  R-EU_R0805  [R0805]
R100  5K6  R-EU_R0805  [R0805]
R101  10K  R-EU_R0805  [R0805]

### Nets
+5V: R86.2 R92.2 R98.2 ; also sheet 2,3,4
CC_ACTIVE: R98.1 R100.2 ; also sheet 4
CV_ACTIVE: R86.1 R89.2 ; also sheet 4
GND [gnd]: C81.1 C82.1 Q16.E Q18.E R84.1 R91.1 R95.2 R96.1 ; supply symbol labelled PGND ; also sheet 1,2,3,4
I_SERVO: R101.1 ; also sheet 3
N$25: C79.2 Q17.B R83.1 R88.2 R90.2
N$39: Q18.B R93.1 R96.2
N$40: C80.2 Q17.C R85.1 R93.2
N$45: IC15.1(A:OUT) IC15.2(B:OUT) R89.1
N$47: Q19.C R90.1
N$48: IC15.13(D:OUT) IC15.14(C:OUT) R100.1
N$49: C83.1 Q19.B R94.1 R97.2
N$53: C80.1 Q16.B R84.2 R85.2
N$153: IC15.5(B:+IN) IC15.6(A:-IN) R82.2
N$161: IC15.8(C:-IN) IC15.11(D:+IN) R101.2
N$170: IC15.7(A:+IN) IC15.9(C:+IN) R87.1 R91.2
N$177: IC15.4(B:-IN) IC15.10(D:-IN) R95.1 R99.2
OUT+: C79.1 Q17.E R83.2 ; also sheet 1,3
OUT-: C83.2 Q19.E R97.1 ; also sheet 3
SENSE+: R88.1 ; also sheet 3
SENSE-: R94.2 ; also sheet 3
SENSE_ERR: Q18.C R92.1 ; also sheet 4
SENSE_PROT: Q16.C ; also sheet 3
U_SERVO: R82.1 ; also sheet 3
V+: C81.2 IC15.3(P:V+) R87.2 ; also sheet 2,3,4
V-: C82.2 IC15.12(P:GND) R99.1 ; also sheet 2,3,4

### Notes on the sheet
- Constant Voltage (CV) and Constant Current (CC) mode indicator | Remote sense reverse polarity detection
- +0.22V
- -2.27V
- CC/CV indicators, Sense error detection
- Licensed under the TAPR Open Hardware License (www.tapr.org/OHL)
- More info at http://www.envox.hr/eez
- Repository: https://github.com/eez-open

## Library data of the parts
C1-C3 C6-C12 C15 C17 C19-C26 C28-C33 C35-C41 C43-C65 C67-C83 = rcl:C-EU: CAPACITOR, European symbol
C4 C5 C18 C27 C34 C42 C66 = EEZ_Lib1:ECAP
C13 C14 = resistor:C-EU: CAPACITOR, European symbol
C16 = Panasonic-EEEFK_EEEFP:EEE-: Aluminum Electrolytic Capacitors,Surface Mount Type; MPN: EEE-FK1J470P; OC_FARNELL: 9696032; OC_NEWARK: 96K9403; PACKAGE: CASE-F; SUPPLIER: PANASONIC; TOLERANCE: ±20 %; VALUE: 47UF; VOLTAGERATING: 63 V
D1-D4 = EEZ_Lib1:VS-6CWQ06FNPBF: Schottky Rectifier, 2 x 3.5 A
D5 D7-D10 = EEZ_Lib1:SCHOTTKY
D6 D11-D18 = diode:DIODE-: DIODE
FB1 = rcl:L-EU: INDUCTOR, European symbol
FB2-FB4 = EEZ_Lib1:FERRITE_BEAD: FAIR-RITE - 2506033007Y3 - FERRITE BEAD, 0.04OHM, 3A, 0603 Farnell: 2112873
GND SW = EEZ_Lib1:PCB_TEST_TAB
IC1 = EEZ_Lib1:LTC3864: 60V Low Iq Step-Down DC/DC Controller with 100% Duty Cycle Capability
IC2 = EEZ_Lib1:MC79LXX: 3-terminal negative voltage regulator, up to 100mA
IC3 = EEZ_Lib1:MC78LXX: μA78L00 series positive voltage regulators
IC4 = EEZ_Lib1:LM5574: Step-Down Switching Regulator; MPN: LM5574MT; OC_FARNELL: 1325419; OC_NEWARK: 32M1267; PACKAGE: TSSOP-16; SUPPLIER: National Semiconductors
IC5 = EEZ_Lib1:LP2951: LP2950-N/LP2951-N Series of Adjustable Micropower Voltage Regulators
IC6 IC7 = EEZ_Lib1:TL072
IC8 = EEZ_Lib1:OP27GSZ: Low Noise, Precision Operational Amplifier
IC9 = EEZ_Lib1:MCP23S08: 8-Bit I/O Expander with SPI; DESCRIPTION: IC I/O EXPANDER; MPN: MCP23S08-E/SO; OC_FARNELL: 1332092; OC_NEWARK: 08J8733; PACKAGE: SOIC-18; SUPPLIER: Microchip
IC10 = EEZ_Lib1:REF50XX: Low-Noise (3μVpp/V), Very Low Drift (max. 8ppm/°C), Precision Voltage Reference Pin compatible with REF2 Farnell: 1439628
IC11 = EEZ_Lib1:DAC8552_DGK_8
IC12 = EEZ_Lib1:ADG465: Single Channel Protector in an SOT-23 Package
IC13 = EEZ_Lib1:TS5A9411DCKT: 10-Ω SPDT ANALOG SWITCH SINGLE-CHANNEL 2:1 MULTIPLEXER/DEMULTIPLEXER; FARNELL: 1755582
IC14 = EEZ_Lib1:ADS1120: Low-Power, Low-Noise, 16-Bit, Analog-to-Digital Converter for Small-Signal Sensors Farnell: 2402249
IC15 = EEZ_Lib1:LM339: Low Power Low Offset Voltage Quad Comparators with open collector; LM139/LM239/LM339/LM2901/LM3302
JP1 JP2 = jump-0r-smd:0R-JUMP: SMD 0R 0805 Jumper
L1 = EEZ_Lib1:RN114: Schaffner EMC/EMI current-compensated chokes, horizontal case; FARNELL: 1191484
L2 = WE-HCI:WE-HCI: SMD-Flat Wire High Current Inductor WE-HCI - Flat wire coil for lower losses at high frequency ranges - Low leakage field - Extremely low profile design - Current loading up to 40 A - Magnetically shielded -- Graphic cards -- Laptops -- Motherboards -- High current switching regulators -- Polyphase-switching regulators -- industrial computers; MPN: 7443551331; OC_FARNELL: 2211631; OC_NEWARK: 44W4647; PACKAGE: 1365; SUPPLIER: Würth Elektronik eiSos GmbH
L3 L4 = EEZ_Lib1:IHLP-2020BZ-11: Low Profile, High Current IHLP® Inductors
L5-L7 = EEZ_Lib1:L1210
LED1 = EEZ_Lib1:LED
NTC1 = EEZ_Lib1:NTC
Q1 Q8 = EEZ_Lib1:P-MOSFET: HEXFET Power MosFet Source: http://www.irf.com/
Q2 Q5 Q10 Q11 Q17 = transistor:*-PNP-: PNP Transistror
Q3 Q15 = EEZ_Lib1:2N7002: N-CHANNEL ENHANCEMENT MODE FIELD EFFECT TRANSISTOR; MPN: 2N7002-7-F; OC_FARNELL: 1713823; OC_NEWARK: 25R5679; PACKAGE: SOT-23-3; SUPPLIER: DIODES INC.
Q4 = EEZ_Lib1:IRFP240: HEXFET Power MosFet Source: http://www.irf.com/
Q6 Q12 Q13 Q16 Q18 Q19 = transistor:*-NPN-: NPN Transistror BF959 corrected 2008.03.06
Q7 Q9 = EEZ_Lib1:BCP56: Low power NPN Transistor, Vceo=80V, Ic=1A, SOT-223
Q14 = EEZ_Lib1:IRLML2246TRPBF: HEXFET Power MOSFET (-20V, -2.6A); MPN: IRLML2246TRPBF; OC_FARNELL: 1888166; OC_NEWARK: 40T7450; PACKAGE: SOT-3; SUPPLIER: International Rectifier; TME: IRLML2246TRPBF
R1-R101 = rcl:R-EU_: RESISTOR, European symbol
SH1 SH2 = EEZ_Lib1:SHORT
TP1 TP2 = EEZ_Lib1:TEST_POINT: Test point for oscilloscope probe
TR1 = EEZ_Lib1:BOURNS_SRF0703INV: Bourns SRF0703 Series - Dual-Winding Shielded Power Inductors
U$11 U$12 = EEZ_Lib1:FIDUCIAL: Fiducial mark for pick and place automation
X1 = EEZ_Lib1:TBLOCK5.0_3A
X2 = EEZ_Lib1:TBLOCK5.0_2A
X3 = EEZ_Lib1:SSW-113-02-T-D-RA: Samtec SSW-113-02-T-D-RA Receptacle, 2.54MM, RA, 26-way; FARNELL: 1805583; TME: ZL263-26DG
ZD1-ZD3 = EEZ_Lib1:P6SMB68A: Transient Voltage Suppression Diodes, DO-214AA
ZD4 ZD5 = EEZ_Lib1:ZENER-DIODE

## Net classes
0 default: width 0.254 mm, drill 0.584 mm, clearance 0.254 mm
1 dgnd: width 0.254 mm, drill 0.584 mm, clearance 0.254 mm
2 gnd: width 0.254 mm, drill 0.584 mm, clearance 0.254 mm